# Altium schematic sheet WifiNode_Per.SchDoc: Per
size A4; Author: Matias Pardo Errecarret; Revision: 1; SheetNumber: 5; SheetTotal: 5
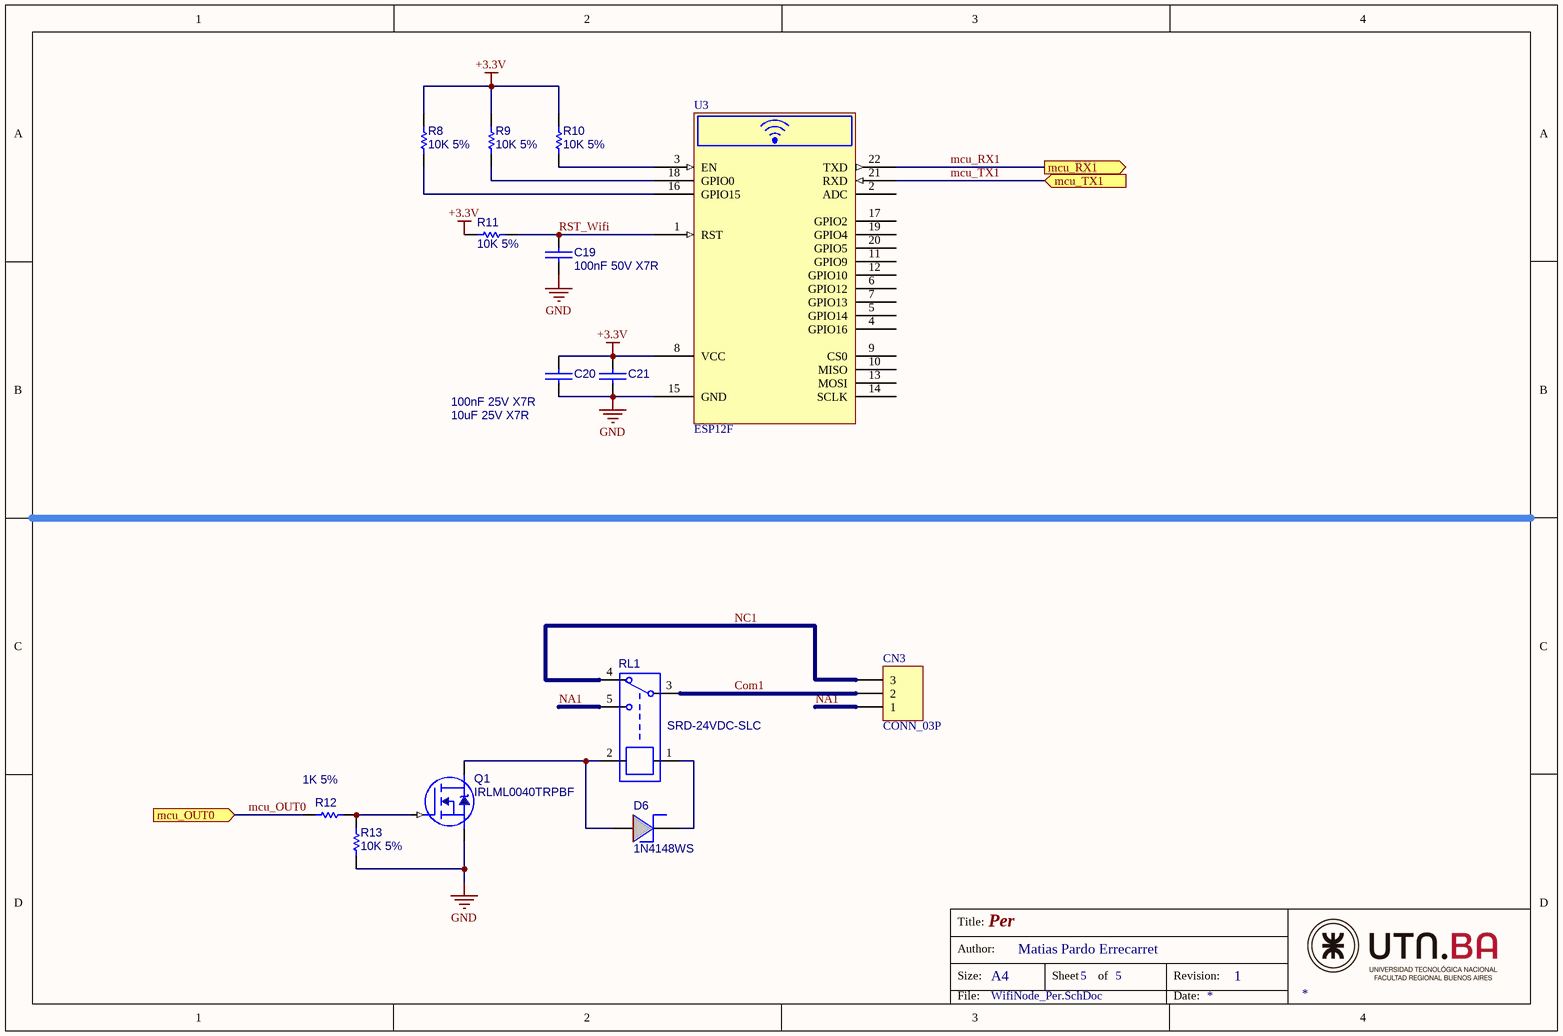
[diagram p0: WifiNode_Per.SchDoc]

## Parts
C19  100nF 50V X7R  [C_0805]
C20  100nF 25V X7R  [C_0805]
C21  10uF 25V X7R  [C_0805]
CN3  CONN_03P  [TerminalBlock_1x3_P5mm]
D6  1N4148WS  [D_SMA]
Q1  IRLML0040TRPBF  [SOT_23]
R8  10K 5%  [R_0805]
R9  10K 5%  [R_0805]
R10  10K 5%  [R_0805]
R11  10K 5%  [R_0805]
R12  1K 5%  [R_0805]
R13  10K 5%  [R_0805]
RL1  SRD-24VDC-SLC  [943-1C]
U3  ESP12F  [ESP12F]

## Ports
mcu_OUT0 (in), mcu_RX1 (out), mcu_TX1 (in)

## Nets
+3.3V: C20.1 C21.1 R8.2 R9.2 R10.2 R11.1 U3.8(VCC)
GND: C19.2 C20.2 C21.2 Q1.2(SOURCE) R13.1 U3.15(GND)
Com1: CN3.2 RL1.3
mcu_OUT0: R12.2 ; port mcu_OUT0
mcu_RX1: U3.22(TXD) ; port mcu_RX1
mcu_TX1: U3.21(RXD) ; port mcu_TX1
NA1: CN3.1 RL1.5
NC1: CN3.3 RL1.4
RST_Wifi: C19.1 R11.2 U3.1(RST)
NetD6_1: D6.1(A) Q1.3(DRAIN) RL1.2
NetD6_2: D6.2(K) RL1.1
NetQ1_1: Q1.1(GATE) R12.1 R13.2
NetR8_1: R8.1 U3.16(GPIO15)
NetR9_1: R9.1 U3.18(GPIO0)
NetR10_1: R10.1 U3.3(EN)

Not connected (* = marked no-connect by the designer): U3 2(ADC) 4(GPIO16) 5(GPIO14) 6(GPIO12) 7(GPIO13) 9(CS0) 10(MISO) 11(GPIO9) 12(GPIO10) 13(MOSI) 14(SCLK) 17(GPIO2) 19(GPIO4) 20(GPIO5)

## Notes on the sheet
- Title:
- Size:
- Author:
- A4
- Sheet
- of
- Revision:
- File:
- Date:

## Library data of the parts
C19-C21 = CAP: Non Polarized Capacitor
CN3 = CONN_03P: Connector Generic 3 Vias
D6 = DIODO_SH: Diode Shottky
Q1 = N_MOSFET_SOT23: Mosfet N-Ch
R8-R13 = Res1: Resistor
RL1 = RELAY SPDT
U3 = ESP12F Wifi Module: Wifi Module